# Altium schematic sheet RAK3162_NRF54L15.SchDoc
size A3; SheetNumber: 1; SheetTotal: 3; PCBA_CODE: 8262XXXX
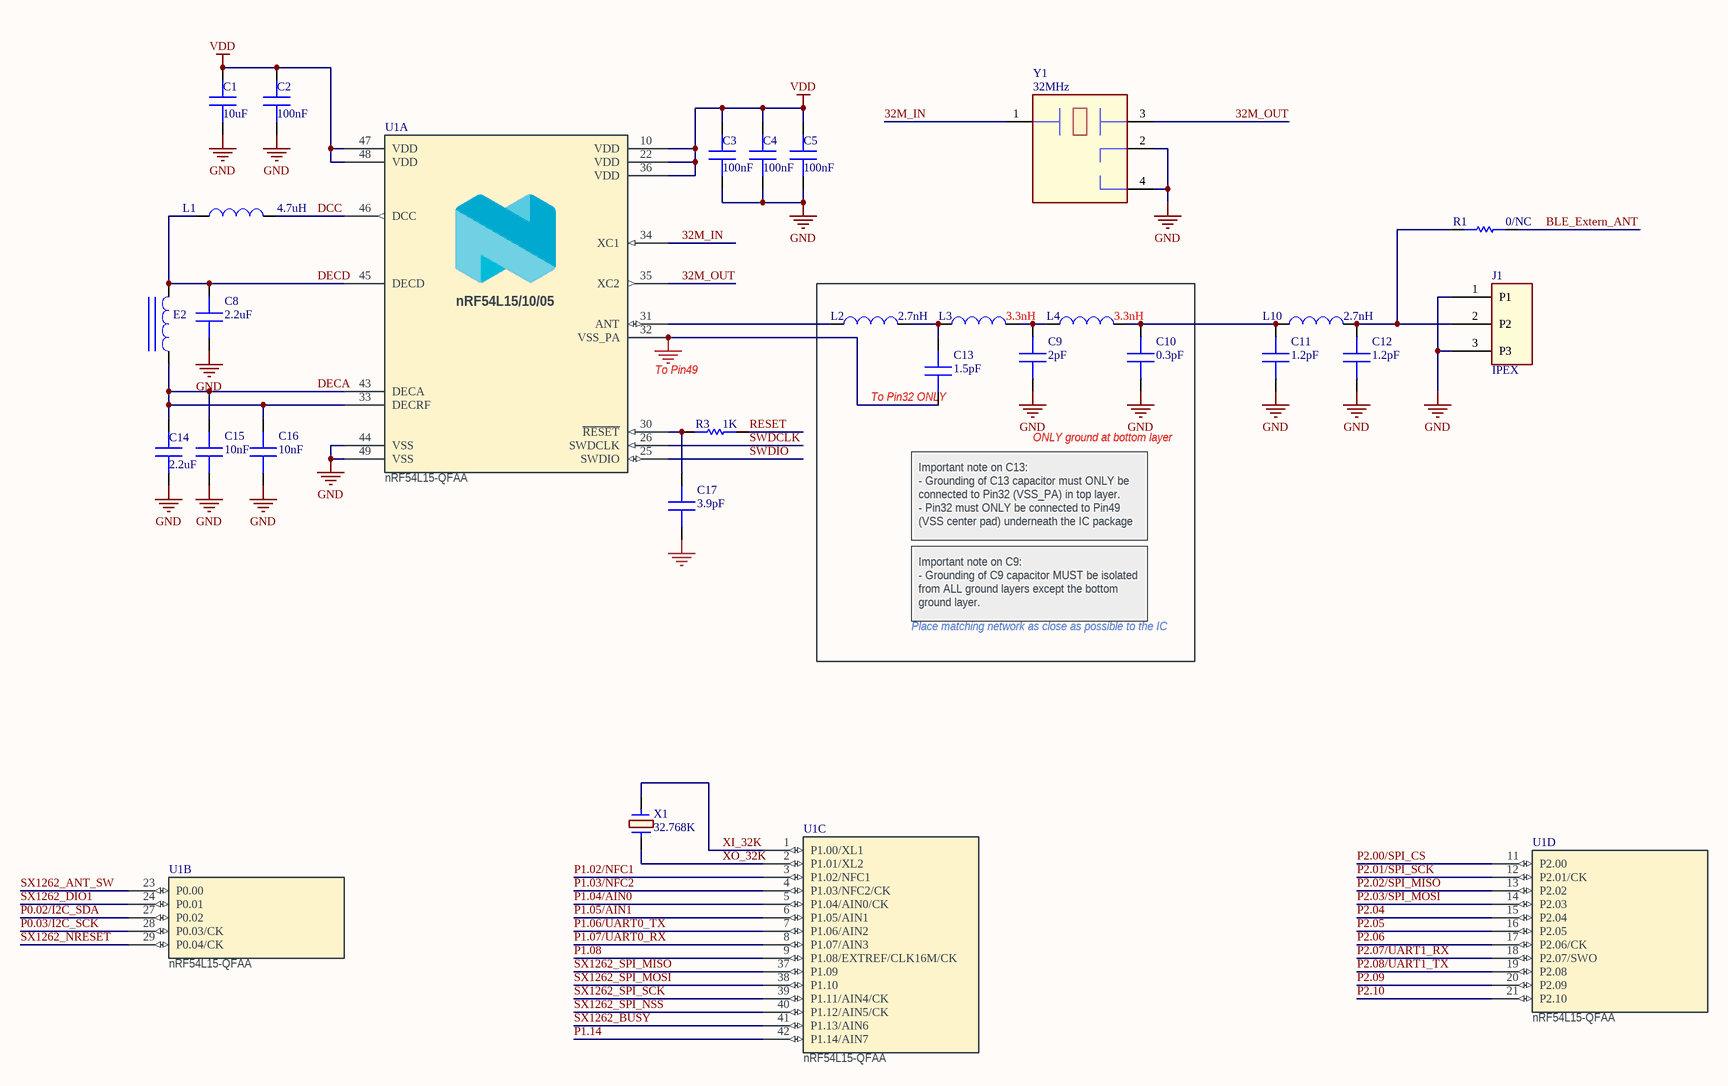
[diagram p0: RAK3162_NRF54L15.SchDoc]

## Parts
C1  value 10uF  [sc0402]  (hidden comment: CAPACITOR NP)
C2  value 100nF  [sc0201]  (hidden comment: CAPACITOR NP)
C3  value 100nF  [sc0201]  (hidden comment: CAPACITOR NP)
C4  value 100nF  [sc0201]  (hidden comment: CAPACITOR NP)
C5  value 100nF  [sc0201]  (hidden comment: CAPACITOR NP)
C8  value 2.2uF  [sc0201]  (hidden comment: CAPACITOR NP)
C9  value 2pF  [sc0201]  (hidden comment: CAPACITOR NP)
C10  value 0.3pF  [sc0201]  (hidden comment: CAPACITOR NP)
C11  value 1.2pF  [sc0201]  (hidden comment: CAPACITOR NP)
C12  value 1.2pF  [sc0201]  (hidden comment: CAPACITOR NP)
C13  value 1.5pF  [sc0201]  (hidden comment: CAPACITOR NP)
C14  value 2.2uF  [sc0201]  (hidden comment: CAPACITOR NP)
C15  value 10nF  [sc0201]  (hidden comment: CAPACITOR NP)
C16  value 10nF  [sc0201]  (hidden comment: CAPACITOR NP)
C17  value 3.9pF  [sc0201]  (hidden comment: CAPACITOR NP)
E2  BEAD  [SL0201]  (value not drawn)
J1  value IPEX  [SCOXSMA_T]  (hidden comment: UFL)
L1  value 4.7uH  [SL0603]  (hidden comment: INDUCTOR)
L2  value 2.7nH  [sl0201]  (hidden comment: INDUCTOR)
L3  value 3.3nH  [sl0201]  (hidden comment: INDUCTOR)
L4  value 3.3nH  [sl0201]  (hidden comment: INDUCTOR)
L10  value 2.7nH  [sl0201]  (hidden comment: INDUCTOR)
R1  value 0/NC  [sr0201]  (hidden comment: RESISTOR)
R3  value 1K  [sr0201]  (hidden comment: RESISTOR)
U1  nRF54L15-QFAA  [QFN40P600X600X90-48N]  (parts A,B,C,D of 4)
X1  32.768K  [CM212H]
Y1  value 32MHz  [S0SC4-2016]  (hidden comment: CRYSTAL_4P)

## Nets
GND: C1.1(POS) C2.1(POS) C3.1(POS) C4.1(POS) C5.1(POS) C8.1(POS) C9.1(POS) C10.1(POS) C11.1(POS) C12.1(POS) C13.1(POS) C14.1(POS) C15.1(POS) C16.1(POS) C17.1(POS) J1.1(P1) J1.3(P3) U1.32(VSS_PA) U1.44(VSS) U1.49(VSS) Y1.2(GND1) Y1.4(GND2)
VDD: C1.2(NEG) C2.2(NEG) C3.2(NEG) C4.2(NEG) C5.2(NEG) U1.10(VDD) U1.22(VDD) U1.36(VDD) U1.47(VDD) U1.48(VDD)
32M_IN: U1.34(XC1) Y1.1(H1)
32M_OUT: U1.35(XC2) Y1.3(H2)
BLE_Extern_ANT: R1.1
DCC: L1.2 U1.46(DCC)
DECA: C14.2(NEG) C15.2(NEG) C16.2(NEG) E2.1 U1.33(DECRF) U1.43(DECA)
DECD: C8.2(NEG) E2.2 L1.1 U1.45(DECD)
P0.02/I2C_SDA: U1.27(P0.02)
P0.03/I2C_SCK: U1.28(P0.03/CK)
P1.02/NFC1: U1.3(P1.02/NFC1)
P1.03/NFC2: U1.4(P1.03/NFC2/CK)
P1.04/AIN0: U1.5(P1.04/AIN0/CK)
P1.05/AIN1: U1.6(P1.05/AIN1)
P1.06/UART0_TX: U1.7(P1.06/AIN2)
P1.07/UART0_RX: U1.8(P1.07/AIN3)
P1.08: U1.9(P1.08/EXTREF/CLK16M/CK)
P1.14: U1.42(P1.14/AIN7)
P2.00/SPI_CS: U1.11(P2.00)
P2.01/SPI_SCK: U1.12(P2.01/CK)
P2.02/SPI_MISO: U1.13(P2.02)
P2.03/SPI_MOSI: U1.14(P2.03)
P2.04: U1.15(P2.04)
P2.05: U1.16(P2.05)
P2.06: U1.17(P2.06/CK)
P2.07/UART1_RX: U1.18(P2.07/SWO)
P2.08/UART1_TX: U1.19(P2.08)
P2.09: U1.20(P2.09)
P2.10: U1.21(P2.10)
RESET: R3.1
SWDCLK: U1.26(SWDCLK)
SWDIO: U1.25(SWDIO)
SX1262_ANT_SW: U1.23(P0.00)
SX1262_BUSY: U1.41(P1.13/AIN6)
SX1262_DIO1: U1.24(P0.01)
SX1262_NRESET: U1.29(P0.04/CK)
SX1262_SPI_MISO: U1.37(P1.09)
SX1262_SPI_MOSI: U1.38(P1.10)
SX1262_SPI_NSS: U1.40(P1.12/AIN5/CK)
SX1262_SPI_SCK: U1.39(P1.11/AIN4/CK)
XI_32K: U1.1(P1.00/XL1) X1.2
XO_32K: U1.2(P1.01/XL2) X1.1
NetC9_2: C9.2(NEG) L3.2 L4.1
NetC10_2: C10.2(NEG) C11.2(NEG) L4.2 L10.1
NetC12_2: C12.2(NEG) J1.2(P2) L10.2 R1.2
NetC13_2: C13.2(NEG) L2.2 L3.1
NetC17_2: C17.2(NEG) R3.2 U1.30(~{RESET})
NetL2_1: L2.1 U1.31(ANT)

## Notes on the sheet
- (near U1) To Pin49
- (near C13) To Pin32 ONLY
- ONLY ground at bottom layer
- Important note on C13:
  - Grounding of C13 capacitor must ONLY be connected to Pin32 (VSS_PA) in top layer.
  - Pin32 must ONLY be connected to Pin49 (VSS center pad) underneath the IC package
- Important note on C9:
  - Grounding of C9 capacitor MUST be isolated from ALL ground layers except the bottom ground layer.
- Place matching network as close as possible to the IC
- Title
- Size:
- Engineer:
- A3
- Revision:
- Date:
- Sheet
- of
- (in symbol nRF54L15-QFAA, part A) nRF54L15/10/05

## Library data of the parts
C1 = 0807C004: Capacitor-10V-10uF-±20%-X5R-0402; MANUFACTURER: YAGEO; Part Number: CC0402MRX5R6BB106; TOLERANCE: ±20%; SYMNAME: CAP; VOLTAGE: 10V; RAK Code: KRAKBJ0807C004; Classification: SMD Ceramic Capacitor; CODE: 0807C004
C2-C5 = 0807B00F: Capacitor-6.3V-100nF-±10%-X5R-0201; MANUFACTURER: YAGEO; Part Number: CC0201KRX5R5BB104; TOLERANCE: ±10%; SYMNAME: CAP; VOLTAGE: 6.3V; RAK Code: K3CA10402KA201; Classification: SMD Ceramic Capacitor; CODE: 0807B00F
C8 C14 = 0807C02F: Capacitor-6.3V-2.2uF-±20%-X5R-0201; MANUFACTURER: YAGEO; Part Number: CC0201MRX5R5BB225; TOLERANCE: ±20%; SYMNAME: CAP; VOLTAGE: 6.3V; RAK Code: KRAKBJ0807C02F; Classification: SMD Ceramic Capacitor; CODE: 0807C02F
C9 = 0807C02M: Capacitor-50V-2pF-±0.1pF-COG-0201; MANUFACTURER: 深圳市宇阳科技发展有限公司; Part Number: C0201COG2R0B500NTA; TOLERANCE: ±0.1pF; SYMNAME: CAP; VOLTAGE: 50V; Classification: SMD Ceramic Capacitor; CODE: 0807C02M
C10 = 0807B00M: Capacitor-50V-0.3pF-±0.1pF-NPO-0201; MANUFACTURER: YAGEO; Part Number: CC0201BRNPO9BNR30; TOLERANCE: ±0.1pF; SYMNAME: CAP; VOLTAGE: 50V; RAK Code: KRAKBJ0807B00M; Classification: SMD Ceramic Capacitor; CODE: 0807B00M
C11 C12 = 0807B00L: Capacitor-50V-1.2pF-±0.1pF-COG-0201; MANUFACTURER: MuRATA; Part Number: GRM0335C1H1R2BA01D; TOLERANCE: ±0.1pF; SYMNAME: CAP; VOLTAGE: 50V; RAK Code: KRAKBJ0807B00L; Classification: SMD Ceramic Capacitor; CODE: 0807B00L
C13 = 0807B00Q: Capacitor-50V-1.5pF-±0.25pF-COG-0201; MANUFACTURER: YAGEO; Part Number: CC0201CRNPO9BN1R5; TOLERANCE: ±0.25pF; SYMNAME: CAP; VOLTAGE: 50V; RAK Code: KRAKBJ0807B00Q; Classification: SMD Ceramic Capacitor; CODE: 0807B00Q
C15 C16 = 0807B00H: Capacitor-10V-10nF-±10%-X7R-0201; MANUFACTURER: YAGEO; Part Number: CC0201KRX7R6BB103; TOLERANCE: ±10%; SYMNAME: CAP; VOLTAGE: 10V; RAK Code: K3CA10303KA201; Classification: SMD Ceramic Capacitor; CODE: 0807B00H
C17 = 0807C00E: Capacitor-50V-3.9pF-±0.25pF-NPO-0201; MANUFACTURER: YAGEO; Part Number: CC0201CRNPO9BN3R9; TOLERANCE: ±0.25pF; SYMNAME: CAP; VOLTAGE: 50V; RAK Code: KRAKBJ0807C00E; Classification: SMD Ceramic Capacitor; CODE: 0807C00E
E2 = 1007C00B: EMI Ferrite Bead-240Ω±25%@100MHz-0.38Ω-350mA-0201; MANUFACTURER: Murata; Part Number: BLM03AX241SN1D; Current: 350mA; Value: 0.38ohm; Tolerance: ±25%; CODE: 1007C00B; Classification: Bead
J1 = 1404A001: Coaxial Connectors-IPEX MHF1-Receptacle, Male Pin-50Ohm-Surface Mount; MANUFACTURER: BLDZ01; PART_NUMBER: ECT818000071; Part Number: L10-03001-01; RAK Code: K6PRUFLRSMT101; CODE: 1404A001; Classification: Coaxial Connectors
L1 = 1003C02M: Power Inductor-4.7uH-±20%-0.5Ω-120mA-0603; MANUFACTURER: TDK; Part Number: MLZ1608M4R7WT000; Current: 120mA; Tolerance: ±20%; Classification: SMD Inductor; CODE: 1003C02M
L2 L10 = 1003B00N: Inductor-2.7nH-±0.1nH-0.2Ω-500mA-0201; MANUFACTURER: MURATA; Part Number: LQP03TN2N7B02D; RAK Code: K3LA027A05A201; Tolerance: ±0.1nH; Classification: SMD Inductor; CODE: 1003B00N
L3 L4 = 1003B00E: Inductor-3.3nH-±0.1nH-0.25Ω-450mA-0201; MANUFACTURER: MURATA; Part Number: LQP03TN3N3B02; RAK Code: KRAKBJ1003B00E; Tolerance: ±0.1nH; Classification: SMD Inductor; CODE: 1003B00E
R1 = 0709B00M: Resistor-0Ω-0.5A-50mΩMAX-0201; MANUFACTURER: YAGEO; Part Number: RC0201JR-070RL; RAK Code: K3RS00000JA201; Classification: Thick Film Resistor; CODE: 0709B00M; Tolerance: 50mΩMAX
R3 = 0709B01A: Resistor-1/20W-1KΩ-±1%-0201; MANUFACTURER: YAGEO; Part Number: RC0201FR-071KL; RAK Code: KRAKBJ0709B01A; Tolerance: ±1%; Classification: Thick Film Resistor; CODE: 0709B01A
U1 = nRF54L15-QFAA: Manufacturer: Nordic Semiconductor; Part number NEMS: 102000370; Component Status: Active; Pad Count: 49; Note: N.A.; Part Number: nRF54L15-QFAA; PartId: 102000370; Component Class: Nordic_Devices; Author: stl1; Manufacturer Part Number: nRF54L15-QFAA; ComponentLink1URL: N.A.; ComponentLink1Description: Datasheet; ComponentLink2URL: N.A.; ComponentLink2Description: Supplier link; HelpURL: N.A.; LatestRevisionDate: 2024-11-27; Published: 2024-11-27; Footprint Doc: QFN-48; Supplier 1: Nordic Semiconductor; Supplier Part Number 1: nRF54L15-QFAA; Supplier 2: N.A.; Supplier Part Number 2: N.A.; Artikkelnr Noca: N.A.; Part number IPS: N.A.; Part number Norautron: N.A.; Value: nRF54L15-QFAA
X1 = 1202C005: Crystal-32.768KHz-12.5pF-±20ppm-−40~+85℃-SMD-2012-2pin; Manufacturer: XTCS01; PSpiceTemplate: X^@REFDES %1 %2 @MODEL; RAK Code: KRAKBJ1202C005; Tolerance: ±20ppm; Value: 32.768K; Code: 1202C005; Part Number: CM212H; Classification: Crystal
Y1 = 1202B004: Crystal-32MHz-6pF-±20ppm-70Ω-SMD-2016-4pin; MANUFACTURER: MURATA; Part Number: XRCGB32M000F2P10R0; RAK Code: KRAKBJ1202B004; Tolerance: ±20ppm; CODE: 1202B004; SYMNAME: CRYSTAL_4P; Classification: Crystal